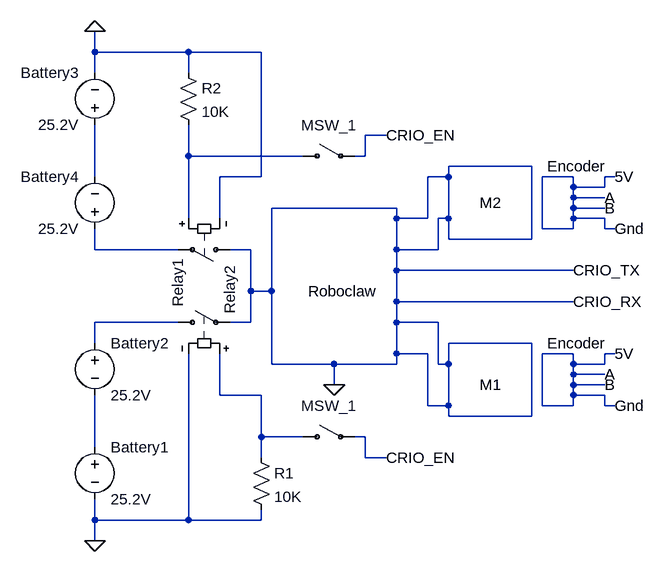
[diagram p0: schematic MotorBatteryAndControlSystem.asc]
MotorBatteryAndControlSystem.asc, the LTspice schematic file:
Version 4
SHEET 1 884 680
WIRE -48 -528 -48 -560
WIRE 96 -528 -48 -528
WIRE 208 -528 96 -528
WIRE -48 -496 -48 -528
WIRE 96 -496 96 -528
WIRE 400 -400 368 -400
WIRE 96 -368 96 -416
WIRE 272 -368 96 -368
WIRE 368 -368 368 -400
WIRE 368 -368 352 -368
WIRE 624 -352 496 -352
WIRE -48 -336 -48 -416
WIRE 208 -336 208 -528
WIRE 208 -336 144 -336
WIRE 496 -336 496 -352
WIRE 496 -336 464 -336
WIRE 688 -336 640 -336
WIRE 752 -336 736 -336
WIRE 688 -320 688 -336
WIRE 736 -320 736 -336
WIRE 736 -320 688 -320
WIRE 688 -304 688 -320
WIRE 736 -304 688 -304
WIRE 416 -288 224 -288
WIRE 688 -288 688 -304
WIRE 736 -288 688 -288
WIRE 96 -272 96 -368
WIRE 144 -272 144 -336
WIRE 416 -272 416 -288
WIRE 464 -272 464 -336
WIRE 464 -272 416 -272
WIRE 496 -272 496 -336
WIRE 496 -272 480 -272
WIRE 688 -272 688 -288
WIRE 736 -272 688 -272
WIRE 640 -256 640 -336
WIRE 688 -256 688 -272
WIRE 688 -256 640 -256
WIRE 736 -256 736 -272
WIRE 752 -256 736 -256
WIRE 496 -240 496 -272
WIRE 624 -240 624 -352
WIRE 624 -240 496 -240
WIRE -48 -224 -48 -256
WIRE 80 -224 -48 -224
WIRE 192 -224 160 -224
WIRE 416 -224 416 -272
WIRE 480 -224 480 -272
WIRE 480 -224 416 -224
WIRE 416 -192 416 -224
WIRE 688 -192 416 -192
WIRE 192 -160 192 -224
WIRE 224 -160 224 -288
WIRE 224 -160 192 -160
WIRE 416 -144 416 -192
WIRE 688 -144 416 -144
WIRE 80 -112 -48 -112
WIRE 192 -112 192 -160
WIRE 192 -112 160 -112
WIRE 416 -112 416 -144
WIRE 480 -112 416 -112
WIRE -48 -80 -48 -112
WIRE 624 -80 496 -80
WIRE 416 -64 416 -112
WIRE 464 -64 416 -64
WIRE 688 -64 640 -64
WIRE 752 -64 736 -64
WIRE 224 -48 224 -160
WIRE 320 -48 224 -48
WIRE 416 -48 416 -64
WIRE 416 -48 320 -48
WIRE 480 -48 480 -112
WIRE 496 -48 496 -80
WIRE 496 -48 480 -48
WIRE 688 -48 688 -64
WIRE 736 -48 736 -64
WIRE 736 -48 688 -48
WIRE 688 -32 688 -48
WIRE 736 -32 688 -32
WIRE 320 -16 320 -48
WIRE 688 -16 688 -32
WIRE 736 -16 688 -16
WIRE 144 0 144 -64
WIRE 208 0 144 0
WIRE 688 0 688 -16
WIRE 736 0 688 0
WIRE 464 16 464 -64
WIRE 496 16 496 -48
WIRE 496 16 464 16
WIRE 640 16 640 -64
WIRE 688 16 688 0
WIRE 688 16 640 16
WIRE 736 16 736 0
WIRE 752 16 736 16
WIRE 496 32 496 16
WIRE 624 32 624 -80
WIRE 624 32 496 32
WIRE 208 64 208 0
WIRE 272 64 208 64
WIRE 368 64 352 64
WIRE -48 80 -48 0
WIRE 208 96 208 64
WIRE 368 96 368 64
WIRE 400 96 368 96
WIRE -48 192 -48 160
WIRE 96 192 96 -64
WIRE 96 192 -48 192
WIRE 208 192 208 176
WIRE 208 192 96 192
WIRE -48 224 -48 192
FLAG -48 224 0
FLAG -48 -560 0
FLAG 320 -16 0
SYMBOL voltage -48 64 R0
SYMATTR InstName Battery1
SYMATTR Value 25.2V
SYMBOL voltage -48 -96 R0
SYMATTR InstName Battery2
SYMATTR Value 25.2V
SYMBOL sw 64 -112 R270
SYMATTR InstName Relay1
SYMATTR Value ""
SYMBOL voltage -48 -400 R180
WINDOW 0 24 96 Left 2
WINDOW 3 24 16 Left 2
SYMATTR InstName Battery3
SYMATTR Value 25.2V
SYMBOL voltage -48 -240 R180
WINDOW 0 24 96 Left 2
WINDOW 3 24 16 Left 2
SYMATTR InstName Battery4
SYMATTR Value 25.2V
SYMBOL sw 176 -224 R90
SYMATTR InstName Relay2
SYMATTR Value ""
SYMBOL res 192 80 R0
SYMATTR InstName R1
SYMATTR Value 10K
SYMBOL res 80 -512 R0
SYMATTR InstName R2
SYMATTR Value 10K
SYMBOL csw 272 64 R270
WINDOW 0 32 40 VTop 2
WINDOW 3 -32 40 VBottom 2
SYMATTR InstName MSW_1
SYMATTR Value ""
SYMBOL csw 272 -368 R270
WINDOW 0 32 40 VTop 2
WINDOW 3 -32 40 VBottom 2
SYMATTR InstName MSW_1
SYMATTR Value ""
TEXT 280 -160 Left 2 !Roboclaw
TEXT 544 -16 Left 2 !M1
TEXT 544 -296 Left 2 !M2
TEXT 400 96 Left 2 !CRIO_EN
TEXT 400 -400 Left 2 !CRIO_EN
TEXT 688 -192 Left 2 !CRIO_TX
TEXT 688 -144 Left 2 !CRIO_RX
TEXT 648 -352 Left 2 !Encoder
TEXT 736 -304 Left 2 !A
TEXT 736 -288 Left 2 !B
TEXT 752 -336 Left 2 !5V
TEXT 752 -256 Left 2 !Gnd
TEXT 648 -80 Left 2 !Encoder
TEXT 736 -32 Left 2 !A
TEXT 736 -16 Left 2 !B
TEXT 752 -64 Left 2 !5V
TEXT 752 16 Left 2 !Gnd

The netlist it stands for:
* MotorBatteryAndControlSystem.asc
V§Battery1 N010 0 25.2V
V§Battery2 N006 N010 25.2V
S§Relay1 N006 0 N008 0
V§Battery3 N003 0 25.2V
V§Battery4 N005 N003 25.2V
S§Relay2 0 N005 N002 0
R1 N008 0 10K
R2 0 N002 10K
W§MSW_1 N008 N009
W§MSW_1 N002 N001
Roboclaw
M1
M2
CRIO_EN
CRIO_EN
CRIO_TX
CRIO_RX
Encoder
A
B
5V
Gnd
Encoder
A
B
5V
Gnd
.backanno
.end